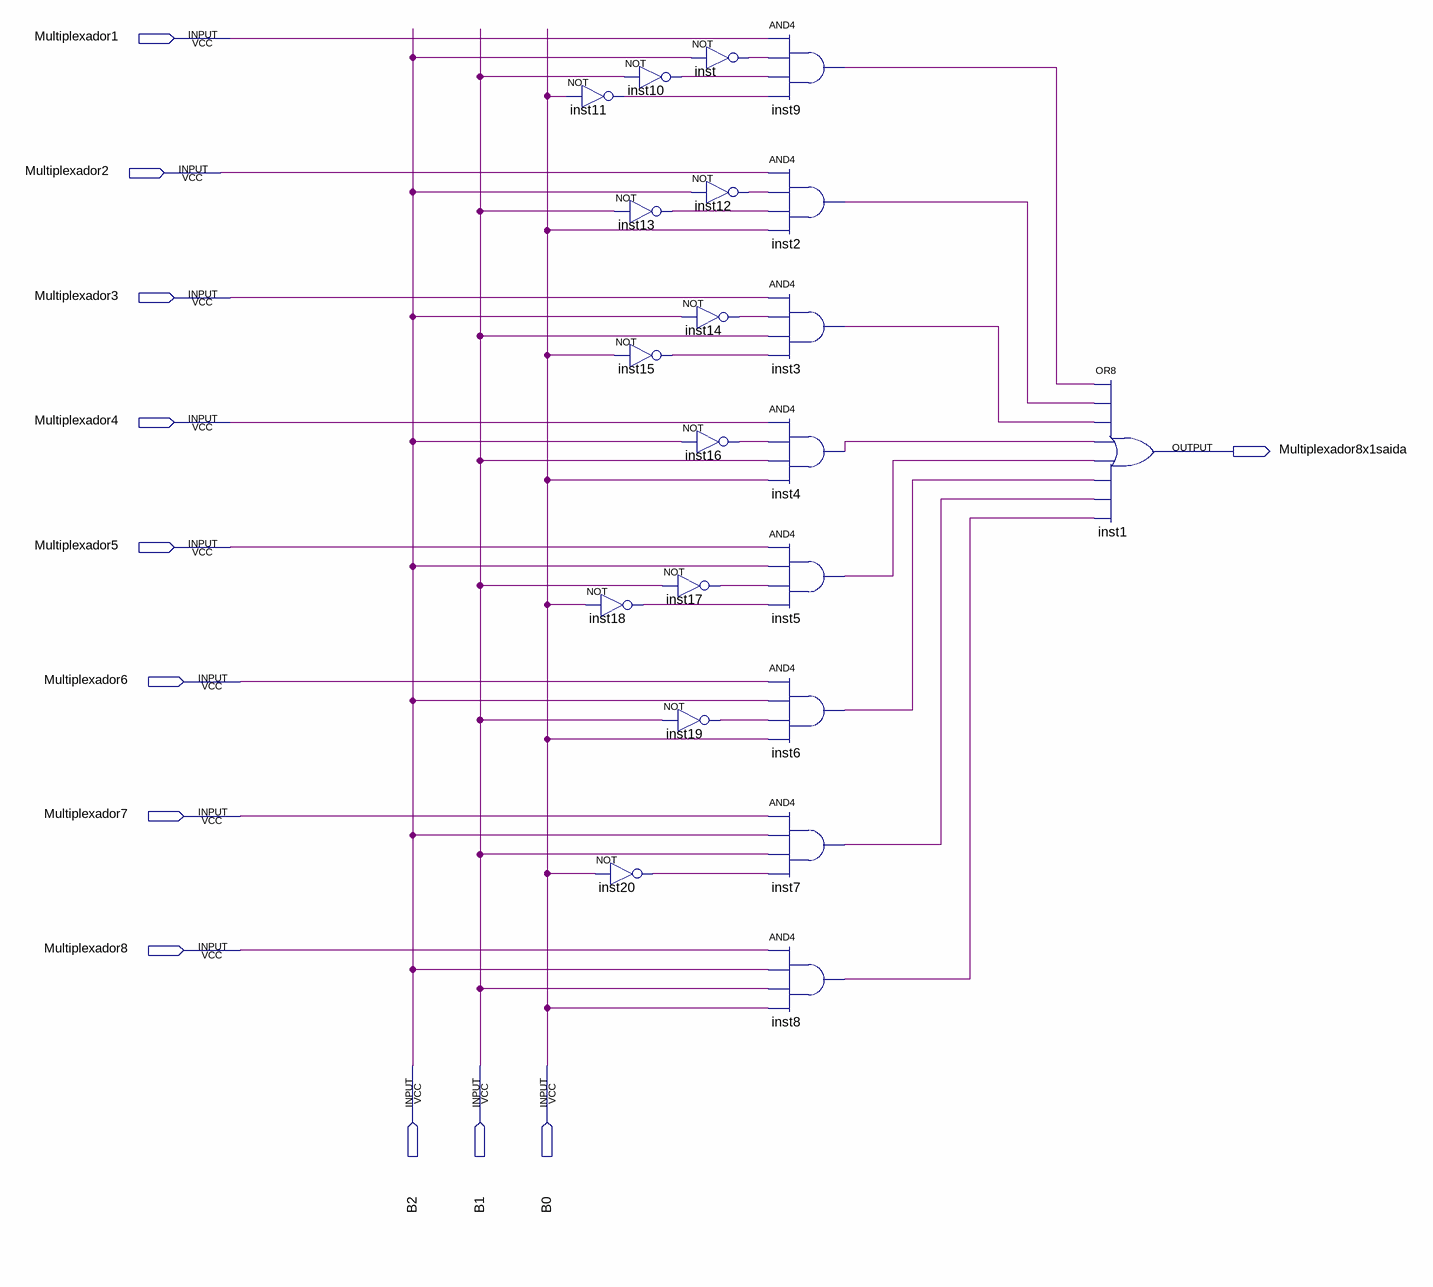
[diagram p0: schematic sheet]
// Quartus schematic multiplexador8x1.bdf as structural Verilog: 21 symbols, 12 pins
module multiplexador8x1 (
  input  Multiplexador1,
  input  Multiplexador2,
  input  Multiplexador3,
  input  Multiplexador4,
  input  Multiplexador5,
  input  Multiplexador6,
  input  Multiplexador7,
  input  Multiplexador8,
  input  B2,
  input  B1,
  input  B0,
  output Multiplexador8x1saida
);

  wire inst2_out, inst3_out, inst4_out, inst5_out, inst6_out, inst7_out, inst8_out, inst9_out, inst10_out,
       inst11_out, inst12_out, inst13_out, inst14_out, inst15_out, inst16_out, inst17_out, inst18_out,
       inst19_out, inst20_out, inst_out;

  not inst10 (inst10_out, B1);
  not inst11 (inst11_out, B0);
  not inst13 (inst13_out, B1);
  not inst15 (inst15_out, B0);
  not inst18 (inst18_out, B0);
  not inst20 (inst20_out, B0);
  not inst (inst_out, B2);
  not inst12 (inst12_out, B2);
  not inst14 (inst14_out, B2);
  not inst16 (inst16_out, B2);
  not inst17 (inst17_out, B1);
  not inst19 (inst19_out, B1);
  and inst9 (inst9_out, Multiplexador1, inst_out, inst10_out, inst11_out);
  and inst2 (inst2_out, Multiplexador2, inst12_out, inst13_out, B0);
  and inst3 (inst3_out, Multiplexador3, inst14_out, B1, inst15_out);
  and inst4 (inst4_out, Multiplexador4, inst16_out, B1, B0);
  and inst5 (inst5_out, Multiplexador5, B2, inst17_out, inst18_out);
  and inst6 (inst6_out, Multiplexador6, B2, inst19_out, B0);
  and inst7 (inst7_out, Multiplexador7, B2, B1, inst20_out);
  and inst8 (inst8_out, Multiplexador8, B2, B1, B0);
  or inst1 (Multiplexador8x1saida, inst9_out, inst2_out, inst3_out, inst4_out, inst5_out, inst6_out, inst7_out, inst8_out);
endmodule
